# EAGLE design epiano (EAGLE 7.3.0)
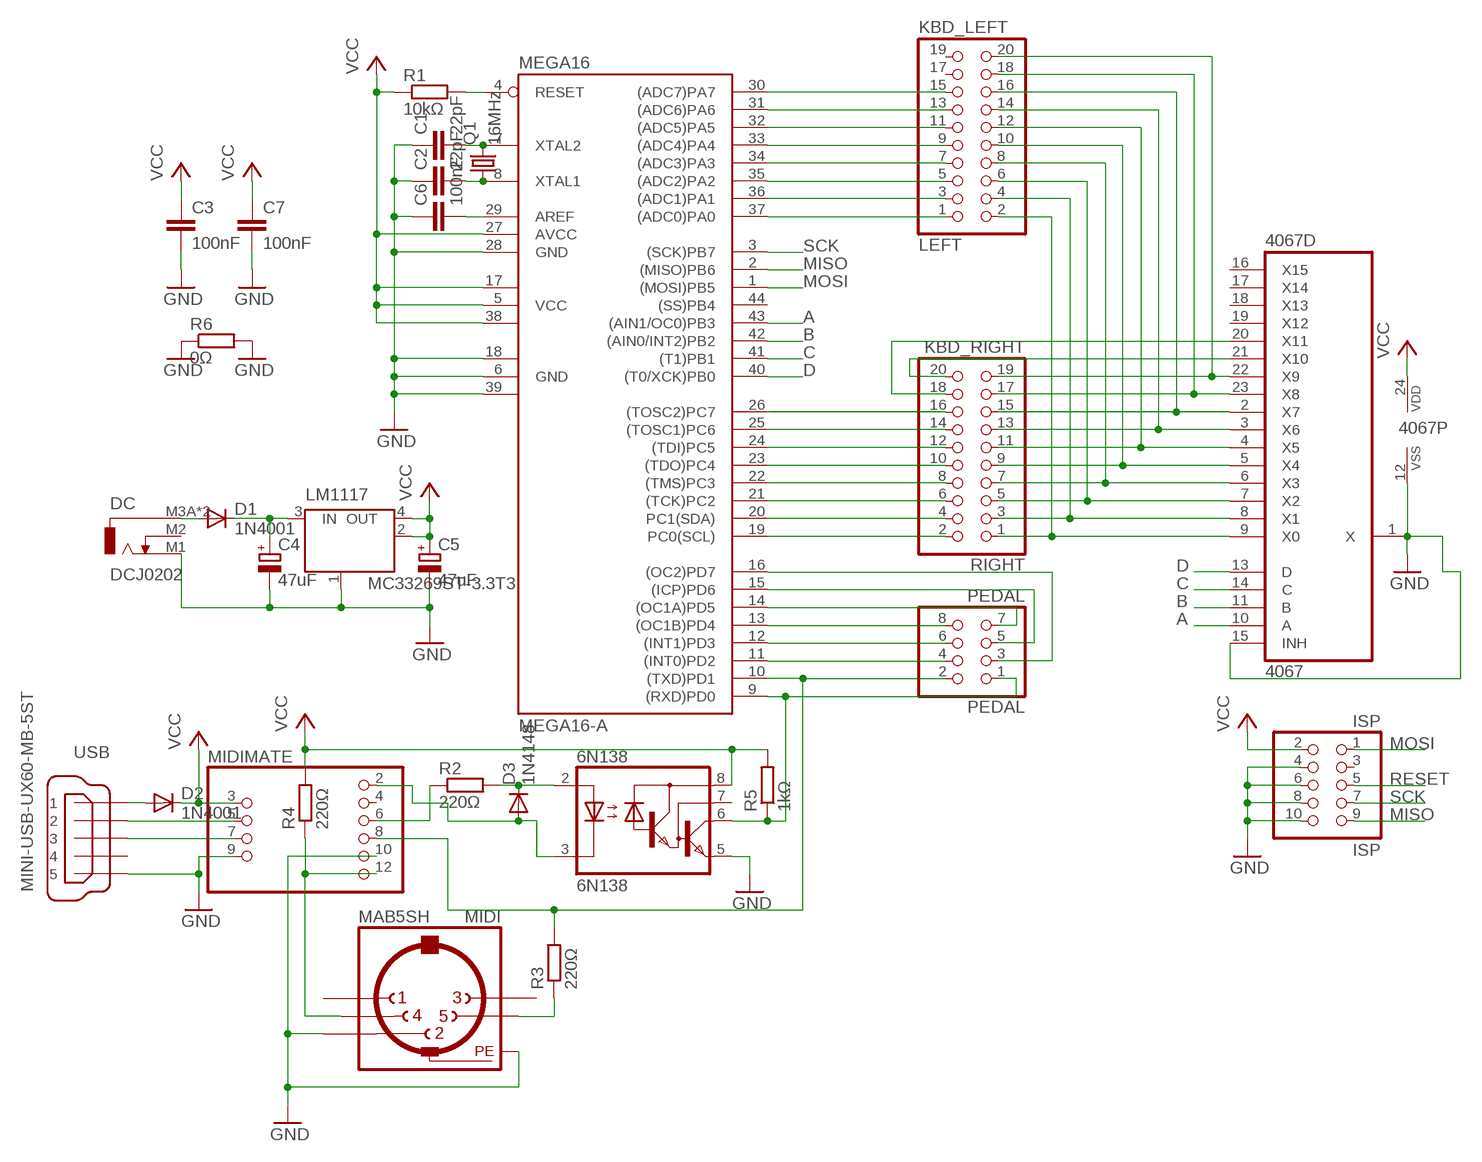
[diagram p0: schematic, sheet 1]

## Parts
6N138  6N138  [SMD-8]
4067  4067D  [SO24W]
C1  22pF  C-EUC0805  [C0805]
C2  22pF  C-EUC0805  [C0805]
C3  100nF  C-EUC0805  [C0805]
C4  47uF  CPOL-EUD  [PANASONIC_D]
C5  47uF  CPOL-EUD  [PANASONIC_D]
C6  100nF  C-EUC0805  [C0805]
C7  100nF  C-EUC0805  [C0805]
D1  1N4001  DIODE-MELF-MLL41  [MELF-MLL41]
D2  1N4001  DIODE-MELF-MLL41  [MELF-MLL41]
D3  1N4148  DIODE-MINIMELF  [MINIMELF]
DC  DCJ0202  [DCJ0202]
ISP  ISP  PINHD-2X5_2.54-SMD  [2X05SMD]
LEFT  KBD_LEFT  PINHD-2X10_2.54-SMD  [2X10SMD]
LM1117  MC33269ST-3.3T3  [SOT223]
MEGA16  MEGA16-A  [TQFP44]
MIDI  MAB5SH  [MAB5SH]
MIDIMATE  USBMIDI_2.54-SMD  [USBMIDI]
PEDAL  PEDAL  PINHD-2X4_2.54-SMD  [2X04SMD]
Q1  16MHz  CRYSTALSM49  [SM49]
R1  10kΩ  R-EU_R0805  [R0805]
R2  220Ω  R-EU_R0805  [R0805]
R3  220Ω  R-EU_R0805  [R0805]
R4  220Ω  R-EU_R0805  [R0805]
R5  1kΩ  R-EU_R0805  [R0805]
R6  0Ω  R-EU_R1206  [R1206]
RIGHT  KBD_RIGHT  PINHD-2X10_2.54-SMD  [2X10SMD]
USB  MINI-USB-UX60-MB-5ST  [UX60-MB-5ST]

## Nets
A: 4067.10(A) MEGA16.43((AIN1/OC0)PB3)
B: 4067.11(B) MEGA16.42((AIN0/INT2)PB2)
C: 4067.14(C) MEGA16.41((T1)PB1)
D: 4067.13(D) MEGA16.40((T0/XCK)PB0)
GND: 6N138.5(GND) 4067.1(X) 4067.12(VSS) 4067.15(INH) C1.1 C2.1 C3.2 C4.- C5.- C6.1 C7.2 DC.M1 ISP.4 ISP.6 ISP.8 ISP.10 LM1117.1(GND/ADJ) MEGA16.6(GND) MEGA16.18(GND1) MEGA16.28(GND) MEGA16.39(GND2) MIDI.2 MIDI.PE MIDI.PE@(PE) MIDIMATE.9 MIDIMATE.10 R6.1 R6.2 USB.5
MISO: ISP.9 MEGA16.2((MISO)PB6)
MOSI: ISP.1 MEGA16.1((MOSI)PB5)
N$1: D2.A USB.1
N$2: MIDIMATE.5 USB.2
N$3: C2.2 MEGA16.8(XTAL1) Q1.1
N$4: C4.+ D1.C LM1117.3(IN)
N$5: MEGA16.19(PC0(SCL)) RIGHT.2
N$6: MEGA16.20(PC1(SDA)) RIGHT.4
N$7: MEGA16.21((TCK)PC2) RIGHT.6
N$8: D1.A DC.M3A DC.M3B
N$9: MEGA16.22((TMS)PC3) RIGHT.8
N$10: MEGA16.23((TDO)PC4) RIGHT.10
N$11: MEGA16.24((TDI)PC5) RIGHT.12
N$12: MEGA16.25((TOSC1)PC6) RIGHT.14
N$13: MEGA16.26((TOSC2)PC7) RIGHT.16
N$14: 4067.20(X11) RIGHT.18
N$15: LEFT.1 MEGA16.37((ADC0)PA0)
N$16: LEFT.3 MEGA16.36((ADC1)PA1)
N$17: LEFT.5 MEGA16.35((ADC2)PA2)
N$18: LEFT.7 MEGA16.34((ADC3)PA3)
N$19: LEFT.9 MEGA16.33((ADC4)PA4)
N$20: LEFT.11 MEGA16.32((ADC5)PA5)
N$21: LEFT.13 MEGA16.31((ADC6)PA6)
N$22: LEFT.15 MEGA16.30((ADC7)PA7)
N$23: 4067.21(X10) RIGHT.20
N$24: 4067.9(X0) LEFT.2 RIGHT.1
N$25: 4067.8(X1) LEFT.4 RIGHT.3
N$26: 4067.7(X2) LEFT.6 RIGHT.5
N$27: 4067.6(X3) LEFT.8 RIGHT.7
N$28: 4067.5(X4) LEFT.10 RIGHT.9
N$29: 4067.4(X5) LEFT.12 RIGHT.11
N$30: 4067.3(X6) LEFT.14 RIGHT.13
N$31: 4067.2(X7) LEFT.16 RIGHT.15
N$32: 4067.23(X8) LEFT.18 RIGHT.17
N$33: 4067.22(X9) LEFT.20 RIGHT.19
N$34: MEGA16.10((TXD)PD1) MIDIMATE.8 PEDAL.2 R3.2
N$35: C6.2 MEGA16.29(AREF)
N$36: MEGA16.11((INT0)PD2) PEDAL.4
N$37: MEGA16.12((INT1)PD3) PEDAL.6
N$38: C1.2 MEGA16.7(XTAL2) Q1.2
N$39: MIDIMATE.7 USB.3
N$40: MIDIMATE.6 R2.1
N$41: MEGA16.13((OC1B)PD4) PEDAL.8
N$42: MIDI.4 MIDIMATE.12 R4.1
N$43: 6N138.3(C) D3.A MIDIMATE.2
N$44: MEGA16.14((OC1A)PD5) PEDAL.7
N$45: MEGA16.15((ICP)PD6) PEDAL.5
N$46: MEGA16.16((OC2)PD7) PEDAL.3
N$47: MIDI.5 R3.1
N$49: 6N138.2(A) D3.C R2.2
N$50: 6N138.6(VO) MEGA16.9((RXD)PD0) PEDAL.1 R5.1
RESET: ISP.5 MEGA16.4(RESET) R1.2
SCK: ISP.7 MEGA16.3((SCK)PB7)
VCC: 6N138.8(VCC) 4067.24(VDD) C3.1 C5.+ C7.1 D2.C ISP.2 LM1117.2(OUT) LM1117.4(OUT) MEGA16.5(VCC) MEGA16.17(VCC1) MEGA16.27(AVCC) MEGA16.38(VCC2) MIDIMATE.3 R1.1 R4.2 R5.2
Unconnected: 6N138.7(VB) 4067.16(X15) 4067.17(X14) 4067.18(X13) 4067.19(X12) DC.M2 ISP.3 LEFT.17 LEFT.19 MEGA16.44((SS)PB4) MIDI.1 MIDI.3 MIDIMATE.4 USB.4

## Library data of the parts
6N138 = epiano:6N138: MOTOROLA OPTO COUPLER; MF: VISHAY/TELEFUNKEN; MPN: 6N138; OC_FARNELL: 9860150; OC_NEWARK: 35K5294
4067 = 40xx:4067: 16-channel ANALOG MULTIPLEXER
C1-C3 C6 C7 = epiano:C-EU: CAPACITOR, European symbol
C4 C5 = rcl:CPOL-EU: POLARIZED CAPACITOR, European symbol
D1-D3 = diode:DIODE-: DIODE
DC = epiano:DCJ0202: DC POWER JACK Source: DCJ0202.pdf; OC_FARNELL: unknown; OC_NEWARK: unknown
ISP = epiano:PINHD-2X5: PIN HEADER
LEFT RIGHT = epiano:PINHD-2X10: PIN HEADER
LM1117 = epiano:MC33269ST*: Adjustable Output Low Dropout Voltage Regulator 800 mA Source: http://www.onsemi.com/pub/Collateral/MC33269-D.PDF
MEGA16 = atmel:MEGA16: MICROCONTROLLER 16 Kbytes FLASH 1 kbytes SRAM 512 bytes EEPROM USART 8-channel 10 bit ADC Source: avr.lbr; MPN: ATMEGA16-16AU; OC_FARNELL: 9171134; OC_NEWARK: 96K6515
MIDI = epiano:MAB5SH: Female CONNECTOR 5 pins 90 deg. with shield, horizontal (DIN 41524); OC_FARNELL: 809883; OC_NEWARK: unknown
MIDIMATE = epiano:USBMIDI: PIN HEADER
PEDAL = epiano:PINHD-2X4: PIN HEADER
Q1 = crystal:CRYSTAL: CRYSTAL; OC_FARNELL: unknown; OC_NEWARK: unknown
R1-R6 = epiano:R-EU_: RESISTOR, European symbol
USB = epiano:MINI-USB-: MINI USB Connector Source: http://www.hirose.co.jp/cataloge_hp/e24000019.pdf; OC_FARNELL: unknown; OC_NEWARK: unknown

## Board
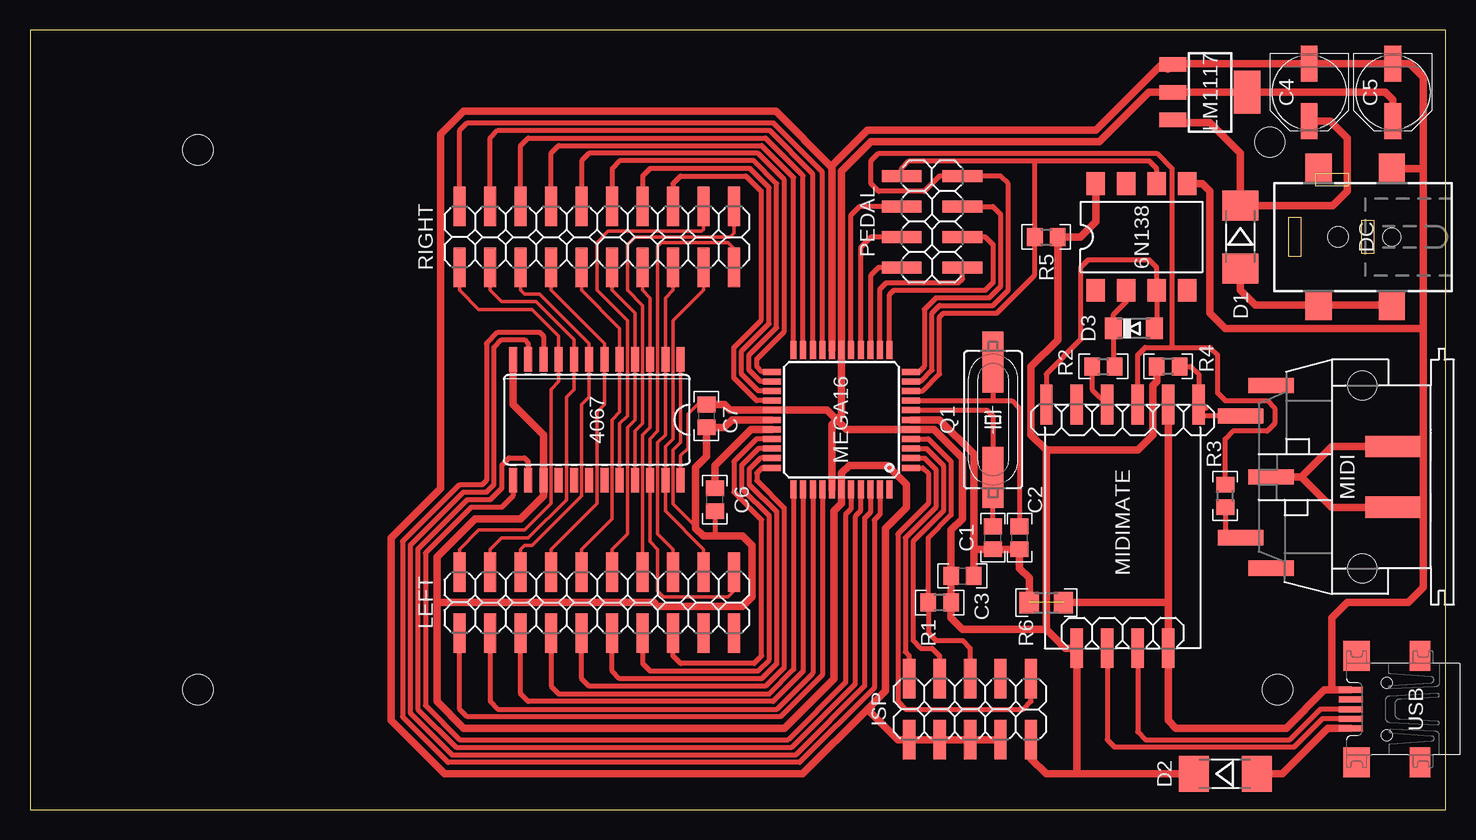
[diagram p1: board, top side]

Size 118 x 65 mm. Coordinates in mm from the lower left corner, seen from the top.
Outline: 0,0 118,0 118,65 0,65 0,0
Copper layers 1: Top 0.035mm
Design rules "epiano": minimum track width 10mil, minimum drill 12mil, track to track 6mil, track to pad 6mil, pad to pad 6mil, via to via 6mil, smd to smd 6mil, copper to edge 40mil, drill to drill 8mil, minimum pad ring 10mil, minimum via ring 8mil, stop-mask expansion 4mil, vias tented up to drill 0mil, thermal gap 10mil
Holes 2.5 mm at 104,10 103.37,55.64 14,55 14,10

### Footprints (pad centres in the part's own frame; a part is rotated, then mirrored left to right if it is on the bottom)
SMD-8 = smd 1.524 x 1.905: 1 -3.81,-4.445; 2 -1.27,-4.445; 3 1.27,-4.445; 4 3.81,-4.445; 5 3.81,4.445; 6 1.27,4.445; 7 -1.27,4.445; 8 -3.81,4.445
SO24W = smd 0.66 x 2.032: 1 -6.985,-5.029; 2 -5.715,-5.029; 3 -4.445,-5.029; 4 -3.175,-5.029; 5 -1.905,-5.029; 6 -0.635,-5.029; 7 0.635,-5.029; 8 1.905,-5.029; 9 3.175,-5.029; 10 4.445,-5.029; 11 5.715,-5.029; 12 6.985,-5.029; 13 6.985,5.029; 14 5.715,5.029; 15 4.445,5.029; 16 3.175,5.029; 17 1.905,5.029; 18 0.635,5.029; 19 -0.635,5.029; 20 -1.905,5.029; 21 -3.175,5.029; 22 -4.445,5.029; 23 -5.715,5.029; 24 -6.985,5.029
C0805 = smd 1.3 x 1.5: 1 -0.95,0; 2 0.95,0
PANASONIC_D = smd 3 x 1.4: + 2.4,0; - -2.4,0
MELF-MLL41 = smd 2.5 x 3: A 2.625,0; C -2.625,0
MINIMELF = smd 1.4 x 1.8: A 1.7,0; C -1.7,0
DCJ0202 = smd 2.5 x 2.2: M1 5.71,-4.99; M2 5.71,1.11; M3A -5.69,-4.99; M3B -5.69,1.11 | hole 1.5: 0,-5 | hole 1.7: 0,-0.5
2X05SMD = smd 1.016 x 3.302: 1 -1.27,-3.81; 2 -1.27,1.27; 3 1.27,-3.81; 4 1.27,1.27; 5 3.81,-3.81; 6 3.81,1.27; 7 6.35,-3.81; 8 6.35,1.27; 9 8.89,-3.81; 10 8.89,1.27
2X10SMD = smd 1.016 x 3.302: 1 -1.27,-3.81; 2 -1.27,1.27; 3 1.27,-3.81; 4 1.27,1.27; 5 3.81,-3.81; 6 3.81,1.27; 7 6.35,-3.81; 8 6.35,1.27; 9 8.89,-3.81; 10 8.89,1.27; 11 11.43,-3.81; 12 11.43,1.27; 13 13.97,-3.81; 14 13.97,1.27; 15 16.51,-3.81; 16 16.51,1.27; 17 19.05,-3.81; 18 19.05,1.27; 19 21.59,-3.81; 20 21.59,1.27
SOT223 = smd 1.219 x 2.235: 1 -2.311,-3.099; 2 0,-3.099; 3 2.311,-3.099 | smd 3.6 x 2.2: 4 0,3.099
TQFP44 = smd 1.5 x 0.5: 1 -5.8,4; 2 -5.8,3.2; 3 -5.8,2.4; 4 -5.8,1.6; 5 -5.8,0.8; 6 -5.8,0; 7 -5.8,-0.8; 8 -5.8,-1.6; 9 -5.8,-2.4; 10 -5.8,-3.2; 11 -5.8,-4; 23 5.8,-4; 24 5.8,-3.2; 25 5.8,-2.4; 26 5.8,-1.6; 27 5.8,-0.8; 28 5.8,0; 29 5.8,0.8; 30 5.8,1.6; 31 5.8,2.4; 32 5.8,3.2; 33 5.8,4 | smd 0.5 x 1.5: 12 -4,-5.8; 13 -3.2,-5.8; 14 -2.4,-5.8; 15 -1.6,-5.8; 16 -0.8,-5.8; 17 0,-5.8; 18 0.8,-5.8; 19 1.6,-5.8; 20 2.4,-5.8; 21 3.2,-5.8; 22 4,-5.8; 34 4,5.8; 35 3.2,5.8; 36 2.4,5.8; 37 1.6,5.8; 38 0.8,5.8; 39 0,5.8; 40 -0.8,5.8; 41 -1.6,5.8; 42 -2.4,5.8; 43 -3.2,5.8; 44 -4,5.8
MAB5SH = smd 1.27 x 3.81: 1 7.62,7.62; 2 0,7.62; 3 -7.62,7.62; 4 5.08,10.16; 5 -5.08,10.16 | smd 1.778 x 4.572: PE -2.54,-2.54; PE@ 2.54,-2.54 | hole 2.4: 7.62,0; -7.62,0
USBMIDI = smd 1.016 x 3.302: 2 -6.35,10.16; 3 -3.81,-10.16; 4 -3.81,10.16; 5 -1.27,-10.16; 6 -1.27,10.16; 7 1.27,-10.16; 8 1.27,10.16; 9 3.81,-10.16; 10 3.81,10.16; 12 6.35,10.16
2X04SMD = smd 1.016 x 3.302: 1 -1.27,-3.81; 2 -1.27,1.27; 3 1.27,-3.81; 4 1.27,1.27; 5 3.81,-3.81; 6 3.81,1.27; 7 6.35,-3.81; 8 6.35,1.27
SM49 = smd 5.08 x 1.778: 1 -4.826,0; 2 4.826,0
R0805 = smd 1.3 x 1.5: 1 -0.95,0; 2 0.95,0
R1206 = smd 1.6 x 1.803: 1 -1.422,0; 2 1.422,0
UX60-MB-5ST = smd 2 x 0.5: 1 2.25,1.6; 2 2.25,0.8; 3 2.25,0; 4 2.25,-0.8; 5 2.25,-1.6 | smd 1.692 x 2.5: M1 -3.546,-4.45; M2 -3.546,4.45 | smd 2.2 x 2.5: M3 1.75,4.45; M4 1.75,-4.45 | hole 0.9: -0.75,-2.2; -0.75,2.2

### Placement (x,y rotation side)
6N138  92.66,47.74 0 top
4067  47.25,32.5 180 top
C1  80.27,22.66 90 top
C2  82.5,22.66 90 top
C3  77.73,19.48 0 top
C4  106.62,59.8 270 top
C5  113.61,59.8 270 top
C6  57.09,25.83 90 top
C7  56.38,32.82 270 top
D1  100.91,47.74 270 top
D2  99.64,2.97 0 top
D3  92.02,40.12 0 top
DC  108.53,47.74 90 top
ISP  82.18,7.1 180 top
LEFT  37.09,18.53 0 top
LM1117  98.37,59.8 270 top
MEGA16  67.66,32.5 180 top
MIDI  111.07,27.74 90 top
MIDIMATE  91.07,23.61 0 top
PEDAL  76.46,51.55 270 top
Q1  80.27,32.5 270 top
R1  75.83,17.26 180 top
R2  89.48,36.95 0 top
R3  99.64,26.15 90 top
R4  94.88,36.95 180 top
R5  84.72,47.74 0 top
R6  84.72,17.26 180 top
RIGHT  37.09,49.01 0 top
USB  112.34,8.37 180 top

### Tracks (layer width: path | path; a pad name or v marks a point on that pad's centre or on a via)
A
  Top 0.406: 4067.10 42.81,39.48 42.49,39.8 39,39.8 38.05,38.85 38.05,27.42 37.73,27.1 35.82,27.1 31.06,22.34 31.06,7.73 34.87,3.93 64.17,3.93 70.38,10.14 70.38,24.13 70.86,24.61 MEGA16.43
B
  Top 0.406: 4067.11 41.54,38.85 41.22,39.17 39.31,39.17 38.68,38.53 38.68,27.1 38.05,26.47 36.14,26.47 31.7,22.02 31.7,8.05 35.19,4.56 63.85,4.56 69.58,10.29 69.58,24.28 70.06,24.76 MEGA16.42
C
  Top 0.406: 4067.14 41.54,29.01 41.22,29.32 39.95,29.32 39.31,28.69 39.31,26.79 38.36,25.83 36.46,25.83 32.33,21.7 32.33,8.37 35.5,5.2 63.53,5.2 68.78,10.45 68.78,24.44 69.23,24.88 69.23,26.31 69.26,26.34 MEGA16.41
D
  Top 0.406: 4067.13 40.27,26.15 39.31,25.2 36.77,25.2 32.97,21.39 32.97,8.69 35.82,5.83 63.21,5.83 67.98,10.6 67.98,24.59 68.46,25.06 MEGA16.40
GND  (1 unrouted)
  Top 0.254: MIDI.2 103.59,27.54 103.82,27.3
  Top 0.305: 4067.1 54.24,30.59 53.6,29.96 53.6,25.5 55.49,23.61
  Top 0.406: C6.1 57.09,22.85 57.06,22.82
  Top 0.61: 33.92,17.26 33.92,9 36.14,6.78 62.9,6.78 67,10.89 67,24.88 67.66,25.53 MEGA16.39 67.66,28.05 68.29,28.69 71.47,28.69 73.06,27.1 73.06,25.2 71.31,23.45 71.31,9.88 69.8,8.37 | 33.92,17.26 33.92,21.07 37.09,24.24 40.9,24.24 42.81,26.15 4067.15 42.81,31.23 40.27,33.77 4067.12 | 33.92,17.26 52.02,17.26 52.33,16.94 59.4,16.94 60.2,17.74 60.2,22.01 59.38,22.82 57.06,22.82 56.12,22.82 55.49,23.45 55.49,23.61 55.49,28.53 56.38,29.42 C7.2 57.87,31.87 58.51,32.5 MEGA16.28 | 95.37,62.41 LM1117.1 | 113.85,62.41 C5.- | 106.96,62.45 C4.- | C5.- C4.- | C5.- 115.02,62.2 116.15,61.08 116.15,53.45 | DC.M1 114.88,53.45 116.15,53.45 | 105.99,27.74 108.53,30.28 MIDI.PE@ 116.15,30.28 | 103.59,27.54 103.78,27.74 105.99,27.74 | MIDI.PE 108.53,25.2 105.99,27.74 | 116.15,30.28 116.15,40.12 | 116.15,40.12 116.15,53.45 | 116.15,30.28 116.15,18.53 114.88,17.26 109.8,17.26 108.53,15.99 108.53,9.97 | C4.- 95.36,62.2 LM1117.1 | 116.15,40.12 99.64,40.12 98.37,41.39 98.37,51.55 97.73,52.19 6N138.5 | LM1117.1 94.87,61.71 94.55,62.03 94.24,62.03 88.84,56.63 69.8,56.63 66.86,53.69 66.86,53.53 | MEGA16.6 75.83,32.5 78.69,29.64 78.69,21.7 | 78.69,21.7 C3.2 | 78.69,21.7 78.69,21.71 C1.1 C2.1 82.5,20.12 83.3,19.32 R6.2 | 94.88,17.26 MIDIMATE.9 94.88,7.42 95.51,6.78 104.72,6.78 107.91,9.97 108.53,9.97 | ISP.4 ISP.6 ISP.8 ISP.10 72.34,5.83 69.8,8.37 | 69.8,8.37 64.4,2.97 34.55,2.97 30.11,7.42 30.11,22.66 34.23,26.79 34.23,56.31 36.14,58.22 62.17,58.22 66.86,53.53 | MEGA16.18 66.86,53.53 | R6.1 94.88,17.26 | MIDIMATE.10 94.88,17.26 | USB.5 108.53,9.97
MISO
  Top 0.406: MEGA16.2 74.58,29.3 75.51,28.37 75.51,25.2 72.97,22.66 72.97,13.13 73.29,12.82 ISP.9
MOSI
  Top 0.406: MEGA16.1 74.43,28.5 74.88,28.05 74.88,25.52 72.34,22.98 72.34,9 72.97,8.37 82.81,8.37 83.45,9 ISP.1
N$1
  Top 0.61: D2.A 104.4,2.97 108.2,6.77 USB.1
N$2
  Top 0.406: MIDIMATE.5 89.8,5.83 90.43,5.2 105.35,5.2 107.73,7.57 USB.2
N$3
  Top 0.406: MEGA16.8 80.27,34.1 | 80.27,34.1 81.85,34.1 82.5,33.45 C2.2 | Q1.1 80.27,34.1
N$4
  Top 0.61: 95.36,57.41 LM1117.3 95.5,57.27 98.37,57.27 100.91,54.73 D1.C 108.62,50.36 109.8,51.55 109.8,56 108.39,57.41 C4.+
N$5
  Top 0.406: RIGHT.2 35.82,56.63 36.46,57.27 61.94,57.27 66.06,53.15 MEGA16.19
N$6
  Top 0.406: RIGHT.4 38.36,56 39,56.63 61.62,56.63 65.26,53 MEGA16.20
N$7
  Top 0.406: RIGHT.6 40.9,55.36 41.54,56 61.31,56 64.46,52.84 MEGA16.21
N$8
  Top 0.61: DC.M3A DC.M3B 102.16,42.05 100.91,43.3 D1.A
N$9
  Top 0.406: RIGHT.8 43.44,54.73 44.08,55.36 60.99,55.36 63.66,52.69 MEGA16.22
N$10
  Top 0.406: RIGHT.10 45.98,54.09 46.62,54.73 60.67,54.73 62.88,52.52 62.88,39.87 60.59,37.58 60.59,36.95 61.03,36.5 MEGA16.23
N$11
  Top 0.406: RIGHT.12 48.52,53.45 49.16,54.09 60.35,54.09 62.24,52.2 62.24,40.19 59.95,37.9 59.95,36.63 60.88,35.7 MEGA16.24
N$12
  Top 0.406: RIGHT.14 51.06,52.82 51.7,53.45 60.04,53.45 60.04,53.42 61.61,51.85 61.61,40.51 59.32,38.22 59.32,36.31 60.73,34.9 MEGA16.25
N$13
  Top 0.406: RIGHT.16 53.6,52.19 54.24,52.82 59.69,52.82 60.97,51.53 60.97,40.82 58.68,38.53 58.68,35.99 60.58,34.1 MEGA16.26
N$14
  Top 0.305: 4067.20 49.16,32.18 49.79,32.82 49.79,40.76 47.25,43.3 47.25,47.26 48.2,48.22 55.98,48.22 56.14,48.38 RIGHT.18
N$15
  Top 0.406: LEFT.1 35.82,8.37 36.46,7.73 62.58,7.73 66.06,11.21 MEGA16.37
N$16
  Top 0.406: LEFT.3 38.36,9 39,8.37 62.26,8.37 65.26,11.37 MEGA16.36
N$17
  Top 0.406: LEFT.5 40.9,9.64 41.54,9 61.94,9 64.46,11.52 MEGA16.35
N$18
  Top 0.406: LEFT.7 43.44,10.27 44.08,9.64 61.62,9.64 63.66,11.67 MEGA16.34
N$19
  Top 0.406: LEFT.9 45.98,10.91 46.62,10.27 61.31,10.27 62.9,11.86 62.9,25.11 60.59,27.42 60.59,28.05 61.03,28.5 MEGA16.33
N$20
  Top 0.406: LEFT.11 48.52,11.55 49.16,10.91 60.99,10.91 62.26,12.18 62.26,24.8 59.95,27.1 59.95,28.37 60.88,29.3 MEGA16.32
N$21
  Top 0.406: LEFT.13 51.06,12.18 51.7,11.55 60.67,11.55 61.62,12.5 61.62,24.48 59.32,26.79 59.32,28.69 60.73,30.1 MEGA16.31
N$22
  Top 0.406: LEFT.15 53.6,12.82 54.24,12.18 60.35,12.18 60.99,12.82 60.99,24.16 58.68,26.47 58.68,29.01 60.58,30.9 MEGA16.30
N$23
  Top 0.305: 4067.21 50.43,31.55 51.06,32.18 51.06,42.02 49.79,43.3 49.79,47.11 50.43,47.74 58.37,47.74 58.68,48.06 RIGHT.20
N$24
  Top 0.305: LEFT.2 35.82,21.7 37.41,23.29 41.22,23.29 43.44,25.52 43.44,35.04 44.08,35.67 4067.9 44.08,39.48 41.86,41.71 37.41,41.71 35.82,43.3 RIGHT.1
N$25
  Top 0.305: LEFT.4 38.36,21.7 39.31,22.66 41.54,22.66 44.71,25.83 44.71,34.41 45.35,35.04 4067.8 45.35,39.17 42.17,42.34 39.31,42.34 38.36,43.3 RIGHT.3
N$26
  Top 0.305: LEFT.6 40.9,21.7 41.22,22.02 41.86,22.02 45.98,26.15 45.98,33.77 46.62,34.41 4067.7 46.62,38.85 42.49,42.98 41.22,42.98 40.9,43.3 RIGHT.5
N$27
  Top 0.305: LEFT.8 43.44,21.7 47.25,25.52 47.25,33.13 47.89,33.77 4067.6 47.89,38.85 43.44,43.3 RIGHT.7
N$28
  Top 0.305: LEFT.10 45.98,21.7 48.52,24.24 48.52,32.5 49.16,33.13 4067.5 49.16,40.12 45.98,43.3 RIGHT.9
N$29
  Top 0.305: LEFT.12 48.52,21.7 49.79,22.98 49.79,31.86 50.43,32.5 4067.4 50.43,41.39 48.52,43.3 RIGHT.11
N$30
  Top 0.305: LEFT.14 51.06,31.23 51.7,31.86 4067.3 51.7,42.66 51.06,43.3 RIGHT.13
N$31
  Top 0.305: LEFT.16 53.6,21.7 52.33,22.98 52.33,30.59 52.97,31.23 4067.2 52.97,42.66 53.6,43.3 RIGHT.15
N$32
  Top 0.305: LEFT.18 56.14,21.7 52.97,24.88 4067.23 52.97,30.28 53.6,30.91 53.6,40.76 56.14,43.3 RIGHT.17
N$33
  Top 0.305: LEFT.20 58.68,18.21 58.21,17.74 52.81,17.74 52.33,18.21 52.33,21.7 51.7,22.34 4067.22 51.7,30.91 52.33,31.55 52.33,46.95 52.65,47.26 58.21,47.26 58.68,46.79 RIGHT.19
N$34
  Top 0.254: 92.39,33.87 MIDIMATE.8
  Top 0.406: R3.2 99.64,30.91 100.28,31.55 103.13,31.55 103.77,32.18 103.77,33.45 103.13,34.09 99.64,34.09 99,34.72 99,37.9 98.37,38.53 95.19,38.53 | MIDIMATE.8 92.34,37.9 92.97,38.53 95.19,38.53 | MEGA16.10 74.27,35.7 75.19,36.63 75.19,41.39 75.83,42.02 80.27,42.02 81.54,43.3 81.54,52.19 80.91,52.82 PEDAL.2 75.83,52.82 74.56,51.55 70.75,51.55 70.11,52.19 70.11,54.09 70.75,54.73 93.92,54.73 95.19,53.45 95.19,38.53
N$35
  Top 0.61: MEGA16.29 60.1,31.7 57.09,28.69 C6.2
N$36
  Top 0.406: PEDAL.4 80.27,50.28 80.91,49.64 80.91,43.61 79.95,42.66 75.51,42.66 74.56,41.71 74.56,36.95 74.11,36.5 MEGA16.11
N$37
  Top 0.406: PEDAL.6 79.64,47.74 80.27,47.11 80.27,43.93 79.64,43.3 72.02,43.3 71.66,42.94 MEGA16.12
N$38
  Top 0.406: MEGA16.7 79.79,33.3 80.27,32.82 Q1.2 C1.2
N$39
  Top 0.406: MIDIMATE.7 92.34,6.46 92.97,5.83 105.04,5.83 107.58,8.37 USB.3
N$40
  Top 0.406: MIDIMATE.6 88.53,35.04 R2.1
N$41
  Top 0.406: MEGA16.13 70.86,43.41 71.38,43.93 77.41,43.93 77.73,44.25 PEDAL.8
N$42
  Top 0.406: R4.1 96.78,36.95 97.42,36.31 MIDIMATE.12 | 98.05,33.45 MIDIMATE.12 | MIDI.4 97.73,32.82 MIDIMATE.12
N$43
  Top 0.406: D3.A 93.92,40.33 6N138.3 93.92,45.2 93.29,45.84 88.21,45.84 87.58,45.2 87.58,39.17 84.72,36.31 MIDIMATE.2
N$44
  Top 0.406: MEGA16.14 70.11,38.36 70.11,44.56 70.75,45.2 PEDAL.7
N$45
  Top 0.406: MEGA16.15 69.26,46.88 70.11,47.74 PEDAL.5
N$46
  Top 0.406: MEGA16.16 68.46,49.58 69.16,50.28 PEDAL.3
N$47
  Top 0.406: 100.87,22.38 MIDI.5 99.64,22.66 R3.1
N$49
  Top 0.254: 91.12,43.91 6N138.2
  Top 0.406: 6N138.2 91.38,42.34 90.32,41.28 D3.C 90.32,37.05 R2.2
N$50
  Top 0.406: 6N138.6 93.92,53.45 93.29,54.09 83.77,54.09 | PEDAL.1 72.65,53.45 73.29,54.09 83.77,54.09 | MEGA16.9 74.42,34.9 75.83,36.31 75.83,41.07 76.14,41.39 80.59,41.39 83.77,44.56 R5.1 83.77,54.09
RESET
  Top 0.406: MEGA16.4 74.89,30.9 76.78,29.01 76.78,24.56 74.88,22.66 R1.2 74.88,14.72 75.51,14.09 77.73,14.09 78.37,13.45 ISP.5
SCK
  Top 0.406: MEGA16.3 74.73,30.1 76.14,28.69 76.14,24.88 73.61,22.34 73.61,14.09 74.24,13.45 75.19,13.45 75.83,12.82 ISP.7
VCC
  Top 0.305: 4067.24 54.24,29.5 54.86,30.12 54.86,32.98 55.65,33.77 C7.1
  Top 0.61: MEGA16.38 66.86,32.1 67.26,32.5 | 67.26,32.5 67.66,32.9 MEGA16.17 67.66,53.22 70.11,55.68 89.16,55.68 93.29,59.8 LM1117.2 LM1117.4 112.97,59.8 113.61,59.17 C5.+ | C7.1 57.88,33.77 58.34,33.3 MEGA16.27 66.45,33.3 67.26,32.5 | R4.2 93.93,35.68 93.61,35.36 93.61,31.23 92.34,29.96 84.72,29.96 | 84.72,29.96 83.45,31.23 83.45,36.95 85.67,39.16 R5.2 87.58,47.74 88.84,49.01 6N138.8 88.72,52.31 | 67.26,32.5 68.06,31.7 MEGA16.5 75.36,31.7 77.73,29.32 77.73,24.24 76.78,23.29 C3.1 R1.1 76.78,15.99 77.73,15.04 84.72,15.04 | 84.72,29.96 84.72,15.04 | 84.72,15.04 86.31,13.45 MIDIMATE.3 87.26,2.97 | D2.C 87.26,2.97 | 87.26,2.97 84.72,2.97 83.45,4.24 ISP.2